# Altium schematic sheet Analog_Modulation_and_Supply.SchDoc
size A3; SheetNumber: 2; SheetTotal: 3
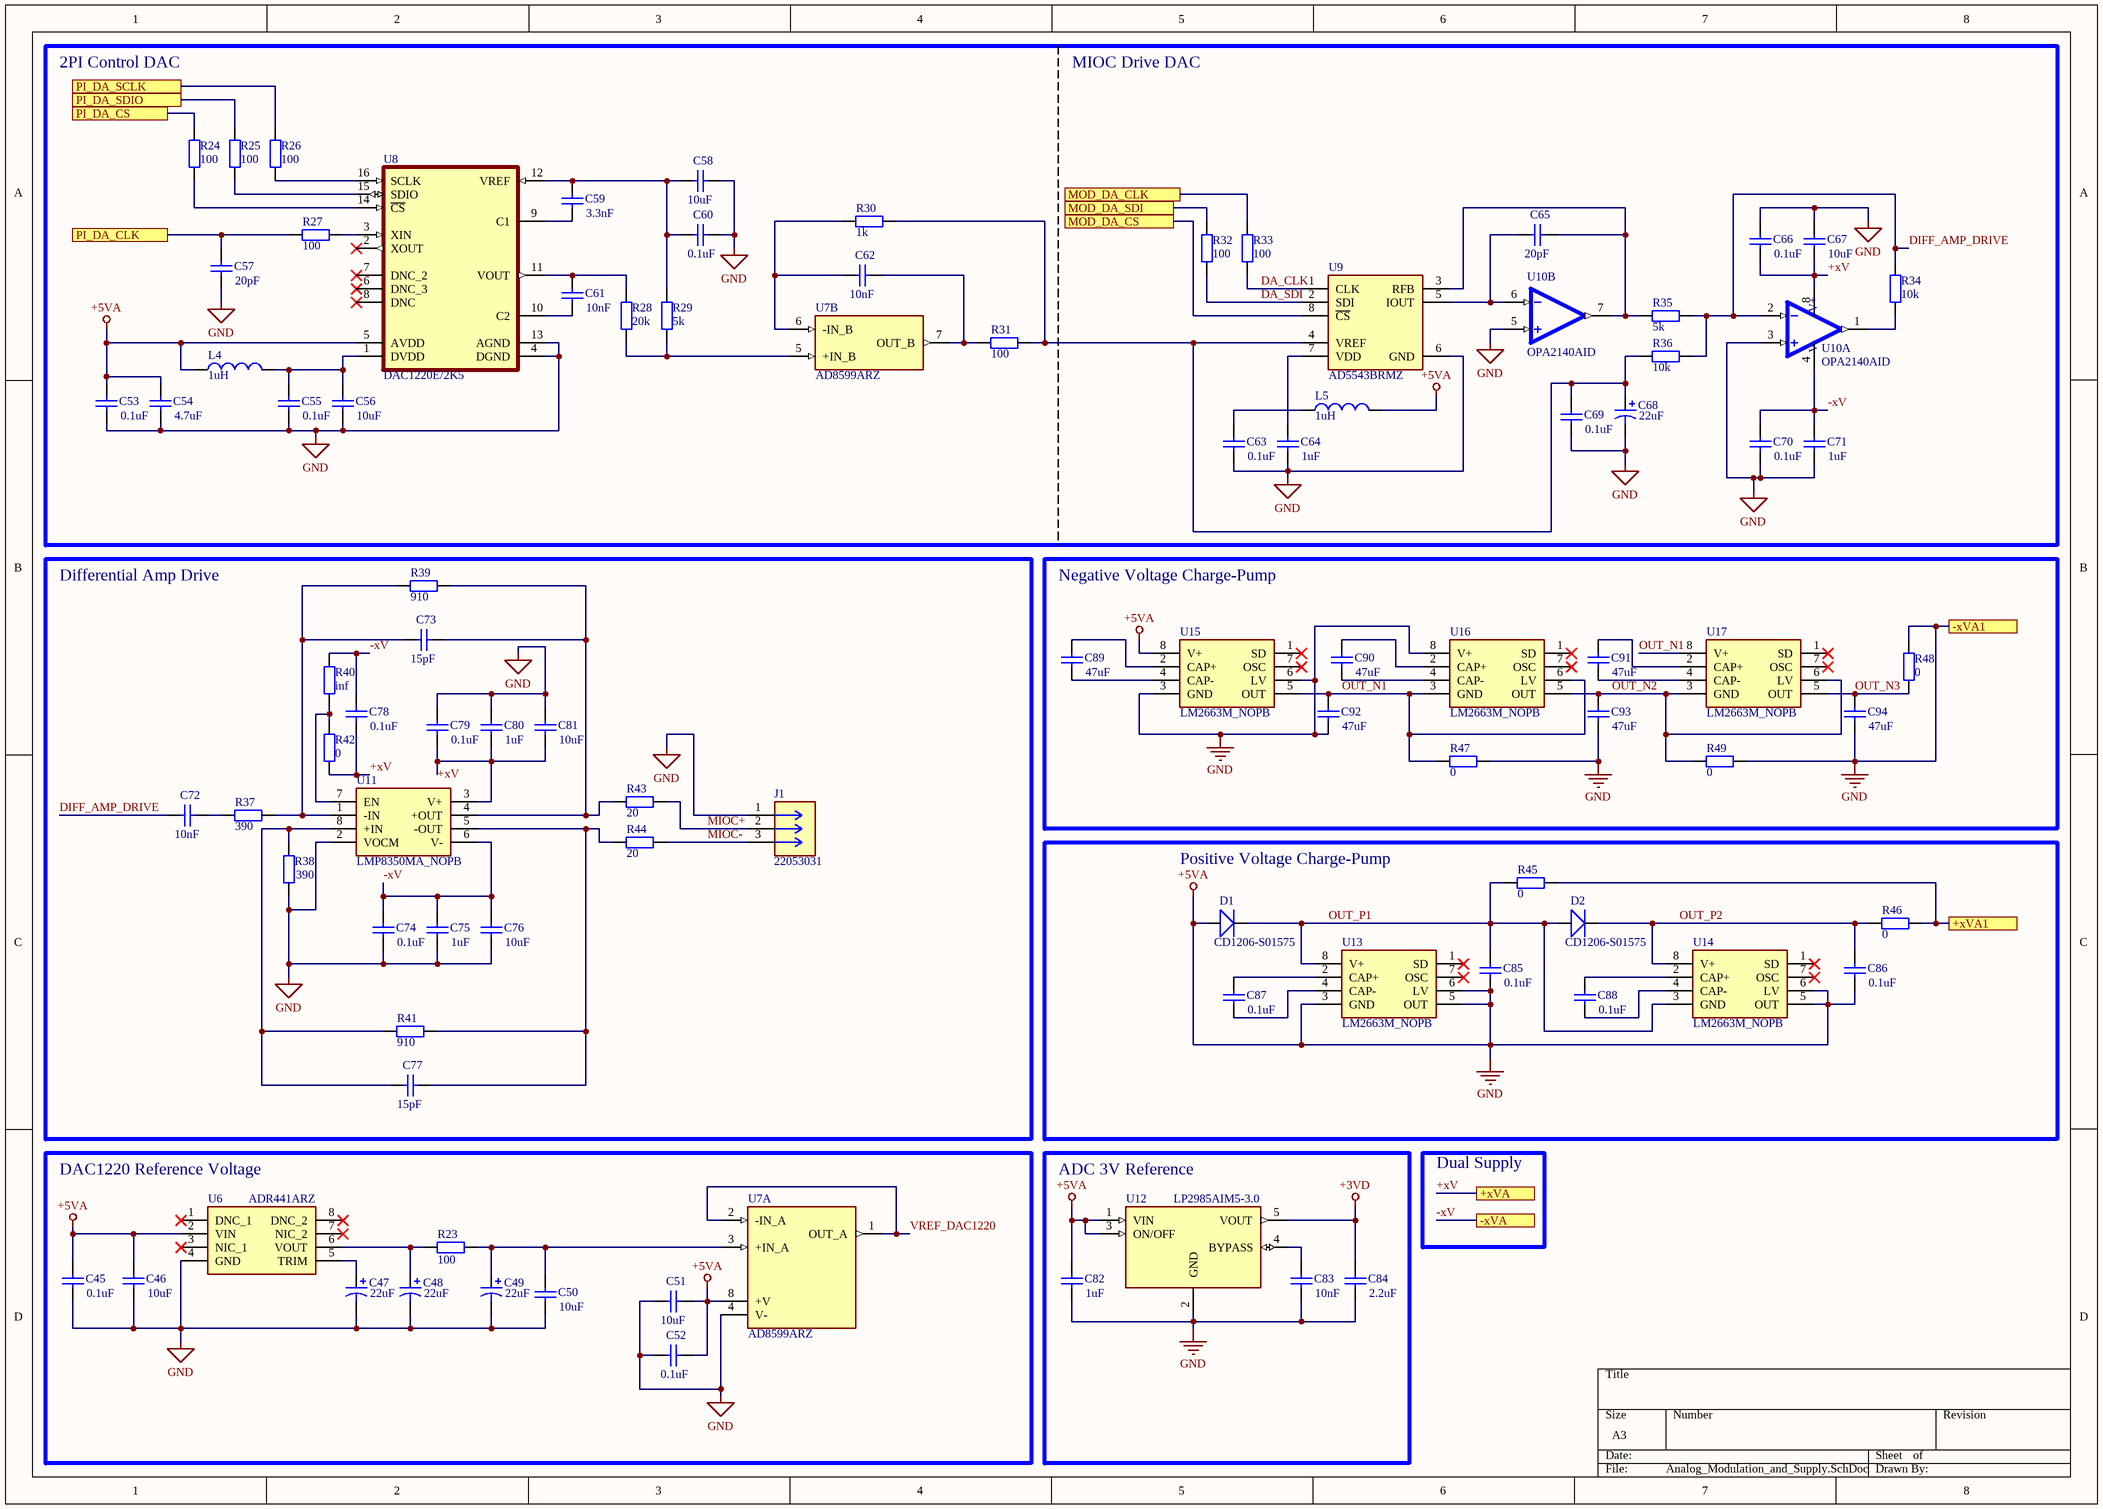
[diagram p0: Analog_Modulation_and_Supply.SchDoc]

## Parts
C45  value 0.1uF  [RAD-0.3]  (hidden comment: Cap)
C46  value 10uF  [RAD-0.3]  (hidden comment: Cap)
C47  value 22uF  [RB7.6-15]  (hidden comment: Cap Pol1)
C48  value 22uF  [RB7.6-15]  (hidden comment: Cap Pol1)
C49  value 22uF  [RB7.6-15]  (hidden comment: Cap Pol1)
C50  value 10uF  [RAD-0.3]  (hidden comment: Cap)
C51  value 10uF  [RAD-0.3]  (hidden comment: Cap)
C52  value 0.1uF  [RAD-0.3]  (hidden comment: Cap)
C53  value 0.1uF  [RAD-0.3]  (hidden comment: Cap)
C54  value 4.7uF  [RAD-0.3]  (hidden comment: Cap)
C55  value 0.1uF  [RAD-0.3]  (hidden comment: Cap)
C56  value 10uF  [RAD-0.3]  (hidden comment: Cap)
C57  value 20pF  [RAD-0.3]  (hidden comment: Cap)
C58  value 10uF  [RAD-0.3]  (hidden comment: Cap)
C59  value 3.3nF  [RAD-0.3]  (hidden comment: Cap)
C60  value 0.1uF  [RAD-0.3]  (hidden comment: Cap)
C61  value 10nF  [RAD-0.3]  (hidden comment: Cap)
C62  value 10nF  [RAD-0.3]  (hidden comment: Cap)
C63  value 0.1uF  [RAD-0.3]  (hidden comment: Cap)
C64  value 1uF  [RAD-0.3]  (hidden comment: Cap)
C65  value 20pF  [RAD-0.3]  (hidden comment: Cap)
C66  value 0.1uF  [RAD-0.3]  (hidden comment: Cap)
C67  value 10uF  [RAD-0.3]  (hidden comment: Cap)
C68  value 22uF  [RB7.6-15]  (hidden comment: Cap Pol1)
C69  value 0.1uF  [RAD-0.3]  (hidden comment: Cap)
C70  value 0.1uF  [RAD-0.3]  (hidden comment: Cap)
C71  value 1uF  [RAD-0.3]  (hidden comment: Cap)
C72  value 10nF  [RAD-0.3]  (hidden comment: Cap)
C73  value 15pF  [RAD-0.3]  (hidden comment: Cap)
C74  value 0.1uF  [RAD-0.3]  (hidden comment: Cap)
C75  value 1uF  [RAD-0.3]  (hidden comment: Cap)
C76  value 10uF  [RAD-0.3]  (hidden comment: Cap)
C77  value 15pF  [RAD-0.3]  (hidden comment: Cap)
C78  value 0.1uF  [RAD-0.3]  (hidden comment: Cap)
C79  value 0.1uF  [RAD-0.3]  (hidden comment: Cap)
C80  value 1uF  [RAD-0.3]  (hidden comment: Cap)
C81  value 10uF  [RAD-0.3]  (hidden comment: Cap)
C82  value 1uF  [RAD-0.3]  (hidden comment: Cap)
C83  value 10nF  [RAD-0.3]  (hidden comment: Cap)
C84  value 2.2uF  [RAD-0.3]  (hidden comment: Cap)
C85  value 0.1uF  [RAD-0.3]  (hidden comment: Cap)
C86  value 0.1uF  [RAD-0.3]  (hidden comment: Cap)
C87  value 0.1uF  [RAD-0.3]  (hidden comment: Cap)
C88  value 0.1uF  [RAD-0.3]  (hidden comment: Cap)
C89  value 47uF  [RAD-0.3]  (hidden comment: Cap)
C90  value 47uF  [RAD-0.3]  (hidden comment: Cap)
C91  value 47uF  [RAD-0.3]  (hidden comment: Cap)
C92  value 47uF  [RAD-0.3]  (hidden comment: Cap)
C93  value 47uF  [RAD-0.3]  (hidden comment: Cap)
C94  value 47uF  [RAD-0.3]  (hidden comment: Cap)
D1  CD1206-S01575  [LED-1206]
D2  CD1206-S01575  [LED-1206]
J1  22053031  [22-05-3031]
L4  value 1uH  [0402-A]  (hidden comment: Inductor)
L5  value 1uH  [0402-A]  (hidden comment: Inductor)
R23  value 100  [AXIAL-0.4]  (hidden comment: Res2)
R24  value 100  [AXIAL-0.4]  (hidden comment: Res2)
R25  value 100  [AXIAL-0.4]  (hidden comment: Res2)
R26  value 100  [AXIAL-0.4]  (hidden comment: Res2)
R27  value 100  [AXIAL-0.4]  (hidden comment: Res2)
R28  value 20k  [AXIAL-0.4]  (hidden comment: Res2)
R29  value 5k  [AXIAL-0.4]  (hidden comment: Res2)
R30  value 1k  [AXIAL-0.4]  (hidden comment: Res2)
R31  value 100  [AXIAL-0.4]  (hidden comment: Res2)
R32  value 100  [AXIAL-0.4]  (hidden comment: Res2)
R33  value 100  [AXIAL-0.4]  (hidden comment: Res2)
R34  value 10k  [AXIAL-0.4]  (hidden comment: Res2)
R35  value 5k  [AXIAL-0.4]  (hidden comment: Res2)
R36  value 10k  [AXIAL-0.4]  (hidden comment: Res2)
R37  value 390  [AXIAL-0.4]  (hidden comment: Res2)
R38  value 390  [AXIAL-0.4]  (hidden comment: Res2)
R39  value 910  [AXIAL-0.4]  (hidden comment: Res2)
R40  value inf  [AXIAL-0.4]  (hidden comment: Res2)
R41  value 910  [AXIAL-0.4]  (hidden comment: Res2)
R42  value 0  [AXIAL-0.4]  (hidden comment: Res2)
R43  value 20  [AXIAL-0.4]  (hidden comment: Res2)
R44  value 20  [AXIAL-0.4]  (hidden comment: Res2)
R45  value 0  [AXIAL-0.4]  (hidden comment: Res2)
R46  value 0  [AXIAL-0.4]  (hidden comment: Res2)
R47  value 0  [AXIAL-0.4]  (hidden comment: Res2)
R48  value 0  [AXIAL-0.4]  (hidden comment: Res2)
R49  value 0  [AXIAL-0.4]  (hidden comment: Res2)
U6  ADR441ARZ  [SOIC127P600X175-8N]
U7  AD8599ARZ  [AD8599ARZ]  (parts A,B of 2)
U8  DAC1220E/2K5  [DAC1220E/2K5]
U9  AD5543BRMZ  [SOP65P490X110-8N]
U10  OPA2140AID  [OPA2140AID]  (parts A,B of 2)
U11  LMP8350MA_NOPB  [LMP8350MA_NOPB]
U12  LP2985AIM5-3.0  [LP2985AIM5-3.0]
U13  LM2663M_NOPB  [LM2663M_NOPB]
U14  LM2663M_NOPB  [LM2663M_NOPB]
U15  LM2663M_NOPB  [LM2663M_NOPB]
U16  LM2663M_NOPB  [LM2663M_NOPB]
U17  LM2663M_NOPB  [LM2663M_NOPB]

## Blocks framed on the sheet
Differential Amp Drive: C72-C81 J1 R37-R44 U11
Negative Voltage Charge-Pump: C89-C94 R47-R49 U15-U17
Positive Voltage Charge-Pump: C85-C88 D1 D2 R45 R46 U13 U14
DAC1220 Reference Voltage: C45-C52 R23 U6 U7
ADC 3V Reference: C82-C84 U12

## Ports
+xVA, +xVA1 (see Digital_Supply_and_Connectors[6A]), -xVA, -xVA1 (see Digital_Supply_and_Connectors[6A]), MOD_DA_CLK (see Digital_Supply_and_Connectors[2B]), MOD_DA_CS (see Digital_Supply_and_Connectors[2B]), MOD_DA_SDI (see Digital_Supply_and_Connectors[2B]), PI_DA_CLK (see Digital_Supply_and_Connectors[2B]), PI_DA_CS (see Digital_Supply_and_Connectors[2B]), PI_DA_SCLK (see Digital_Supply_and_Connectors[3B]), PI_DA_SDIO (see Digital_Supply_and_Connectors[3B])

## Nets
+3VD: C84.1 U12.5(VOUT)
+5VA: C45.1 C45.2 C46.1 C46.2 C47.2 C48.2 C49.2 C50.1 C51.1 C51.2 C52.1 C52.2 C53.1 C53.2 C54.1 C54.2 C55.2 C56.2 C57.2 C58.1 C60.1 C63.2 C64.2 C66.1 C67.1 C68.2 C69.1 C70.2 C71.2 C74.2 C75.2 C76.2 C79.1 C80.1 C81.1 C82.1 C82.2 C83.2 C84.2 C85.2 C86.2 C92.2 C93.2 C94.2 D1.POS J1.1 L4.1 L5.2 R38.2 R47.1 R48.1 R49.1 U6.2(VIN) U6.4(GND) U7.4(V-) U7.8(+V) U8.4(DGND) U8.5(AVDD) U8.13(AGND) U9.6(GND) U10.3(+INA) U10.5(+INB) U11.2(VOCM) U12.1(VIN) U12.2(GND) U12.3(ON/OFF) U13.3(GND) U13.5(OUT) U13.6(LV) U14.5(OUT) U14.6(LV) U15.3(GND) U15.6(LV) U15.8(V+) U16.8(V+) ; port -xVA1  [also labelled GND]
+xV: C66.2 C67.2 C78.2 R42.2 U10.8(V+) ; port +xVA
+xVA1: R45.1 R46.1 ; port +xVA1
-xV: C70.1 C71.1 C74.1 C75.1 C76.1 C78.1 R40.1 U10.4(V-) U11.6(V-) ; port -xVA
DA_CLK: R33.2 U9.1(CLK)
DA_SDI: R32.2 U9.2(SDI)
DIFF_AMP_DRIVE: C72.2 R34.1 R35.1 R36.1 U10.2(-INA)
MIOC+: J1.2 R43.1
MIOC-: J1.3 R44.1
MOD_DA_CLK: R33.1 ; port MOD_DA_CLK
MOD_DA_CS: U9.8(~{CS}) ; port MOD_DA_CS
MOD_DA_SDI: R32.1 ; port MOD_DA_SDI
OUT_N1: C92.1 R47.2 U15.5(OUT) U16.3(GND) U16.6(LV) U17.8(V+)
OUT_N2: C93.1 R49.2 U16.5(OUT) U17.3(GND) U17.6(LV)
OUT_N3: C94.1 R48.2 U17.5(OUT)
OUT_P1: C85.1 D1.NEG D2.POS R45.2 U13.8(V+) U14.3(GND)
OUT_P2: C86.1 D2.NEG R46.2 U14.8(V+)
PI_DA_CLK: C57.1 R27.2 ; port PI_DA_CLK
PI_DA_CS: R24.2 ; port PI_DA_CS
PI_DA_SCLK: R26.2 ; port PI_DA_SCLK
PI_DA_SDIO: R25.2 ; port PI_DA_SDIO
VREF_DAC1220: U7.1(OUT_A) U7.2(-IN_A)
NetC47_1: C47.1 U6.5(TRIM)
NetC48_1: C48.1 R23.1 U6.6(VOUT)
NetC49_1: C49.1 C50.2 R23.2 U7.3(+IN_A)
NetC55_1: C55.1 C56.1 L4.2 U8.1(DVDD)
NetC58_2: C58.2 C59.1 C60.2 R29.2 U8.12(VREF)
NetC59_2: C59.2 U8.9(C1)
NetC61_1: C61.1 R28.2 U8.11(VOUT)
NetC61_2: C61.2 U8.10(C2)
NetC62_1: C62.1 R31.2 U7.7(OUT_B)
NetC62_2: C62.2 R30.2 U7.6(-IN_B)
NetC63_1: C63.1 L5.1
NetC64_1: C64.1 U9.7(VDD)
NetC65_1: C65.1 R35.2 U9.3(RFB) U10.7(OUTB)
NetC65_2: C65.2 U9.5(IOUT) U10.6(-INB)
NetC68_1: C68.1 C69.2 R30.1 R31.1 R36.2 U9.4(VREF)
NetC72_1: C72.1 R37.2
NetC73_1: C73.1 R39.1 R43.2 U11.4(+OUT)
NetC73_2: C73.2 R37.1 R39.2 U11.1(-IN)
NetC77_1: C77.1 R41.1 R44.2 U11.5(-OUT)
NetC77_2: C77.2 R38.1 R41.2 U11.8(+IN)
NetC79_2: C79.2 C80.2 C81.2 U11.3(V+)
NetC83_1: C83.1 U12.4(BYPASS)
NetC87_1: C87.1 U13.2(CAP+)
NetC87_2: C87.2 U13.4(CAP-)
NetC88_1: C88.1 U14.2(CAP+)
NetC88_2: C88.2 U14.4(CAP-)
NetC89_1: C89.1 U15.2(CAP+)
NetC89_2: C89.2 U15.4(CAP-)
NetC90_1: C90.1 U16.2(CAP+)
NetC90_2: C90.2 U16.4(CAP-)
NetC91_1: C91.1 U17.2(CAP+)
NetC91_2: C91.2 U17.4(CAP-)
NetR24_1: R24.1 U8.14(~{CS})
NetR25_1: R25.1 U8.15(SDIO)
NetR26_1: R26.1 U8.16(SCLK)
NetR27_1: R27.1 U8.3(XIN)
NetR28_1: R28.1 R29.1 U7.5(+IN_B)
NetR34_2: R34.2 U10.1(OUTA)
NetR40_2: R40.2 R42.1 U11.7(EN)

Not connected (* = marked no-connect by the designer): U6 1(DNC_1)* 3(NIC_1)* 7(NIC_2)* 8(DNC_2)*; U8 2(XOUT)* 6(DNC_3)* 7(DNC_2)* 8(DNC)*; U13 1(SD)* 7(OSC)*; U14 1(SD)* 7(OSC)*; U15 1(SD)* 7(OSC)*; U16 1(SD)* 7(OSC)*; U17 1(SD)* 7(OSC)*

## Notes on the sheet
- 2PI Control DAC
- MIOC Drive DAC
- Dual Supply
- Labels drawn without touching a wire or pin: +xV

## Library data of the parts
C45 C46 C50-C67 C69-C94 = Cap: Capacitor; Published: 8-Jun-2000; LatestRevisionDate: 17-Jul-2002; LatestRevisionNote: Re-released for DXP Platform.; PackageReference: RAD-0.3; Publisher: Altium Limited; PackageDescription: Radial Cap, Thru-Hole; 2 Leads; 0.3 in Pin Spacing
C47-C49 C68 = Cap Pol1: Polarized Capacitor (Radial); Published: 8-Jun-2000; LatestRevisionDate: 17-Jul-2002; LatestRevisionNote: Re-released for DXP Platform.; PackageReference: RB7.6-15; Publisher: Altium Limited; PackageDescription: Polarized Capacitor (Radial); 2 Leads
D1 D2 = CD1206-S01575: CD1206-S01575, SMT Switching Diode, Vr=75V 150mA, 4ns, 2-Pin 1206 | Bourns CD1206-S01575; SnapEDA_Link: https://www.snapeda.com/parts/CD1206-S01575/Bourns/view-part/?ref=snap; Package: 1206 Bourns; Value: *; MF: Bourns; MP: CD1206-S01575; Check_prices: https://www.snapeda.com/parts/CD1206-S01575/Bourns/view-part/?ref=eda
J1 = 22053031: Headers R/A PCB HDR 3P TIN FRICTION LOCK | Molex Incorporated 22-05-3031; SnapEDA_Link: https://www.snapeda.com/parts/22-05-3031/Molex/view-part/?ref=snap; Package: None; Value: *; MF: Molex; MP: 22-05-3031; Check_prices: https://www.snapeda.com/parts/22-05-3031/Molex/view-part/?ref=eda
L4 L5 = Inductor: Code_IEC: 1005; Published: 8-Jun-2000; LatestRevisionDate: 29-May-2009; LatestRevisionNote: IPC-7351 Footprint Added.; PackageReference: 0402-A; Publisher: Altium Limited; PackageDescription: Chip Inductor; Code_JEITA: 0402
R23-R49 = Res2: Resistor; Published: 8-Jun-2000; LatestRevisionDate: 17-Jul-2002; LatestRevisionNote: Re-released for DXP Platform.; PackageReference: AXIAL-0.4; Publisher: Altium Limited; PackageDescription: Axial Device, Thru-Hole; 2 Leads; 0.4 in Pin Spacing
U6 = ADR441ARZ: Series Voltage Reference IC Fixed 2.5V V +/-0.12% 10 mA 8-SOIC; Manufacturer_Name: Analog Devices; Geometry.Height: 1.75mm; Manufacturer_Part_Number: ADR441ARZ; Mouser Part Number: 584-ADR441ARZ; Mouser Price/Stock: https://www.mouser.co.uk/ProductDetail/Analog-Devices/ADR441ARZ?qs=WIvQP4zGanjF%252B9HT%2FrItQQ%3D%3D; Arrow Part Number: ADR441ARZ; Arrow Price/Stock: https://www.arrow.com/en/products/adr441arz/analog-devices?region=europe; Datasheet Link: https://www.analog.com/media/en/technical-documentation/data-sheets/adr440_441_443_444_445.pdf
U7 = AD8599ARZ: Ultralow Distortion, Ultralow Noise Op Amp (Dual); MF: Analog Devices; Package: SOIC-8 Analog Devices; Price: None; Check_prices: https://www.snapeda.com/parts/AD8599ARZ/Analog+Devices/view-part/?ref=eda; Value: *; SnapEDA_Link: https://www.snapeda.com/parts/AD8599ARZ/Analog+Devices/view-part/?ref=snap; MP: AD8599ARZ; Availability: In Stock; Purchase-URL: https://pricing.snapeda.com/search?q=AD8599ARZ&ref=eda
U8 = DAC1220E/2K5: Digital-to-Analog Converter; Package: None; Price: None; Value: *; MP: DAC1220E/2K5; Availability: Unavailable
U9 = AD5543BRMZ: AD5543BRMZ, 16-Bit General Purpose DAC 2.47Msps, SPI, 8-Pin MSOP; Manufacturer_Name: Analog Devices; Geometry.Height: 1.1mm; Manufacturer_Part_Number: AD5543BRMZ; Mouser Part Number: 584-AD5543BRMZ; Mouser Price/Stock: https://www.mouser.co.uk/ProductDetail/Analog-Devices/AD5543BRMZ?qs=NmRFExCfTkGF7F9gS5LwsA%3D%3D; Arrow Part Number: AD5543BRMZ; Arrow Price/Stock: https://www.arrow.com/en/products/ad5543brmz/analog-devices?utm_currency=USD&region=nac; Datasheet Link: http://www.analog.com/static/imported-files/data_sheets/AD5543_5553.pdf
U10 = OPA2140AID: Dual-channel, 11-MHz, low-noise 36-V JFET precision operational amplifier with rail-to-rail output; MF: Texas Instruments; SnapEDA_Link: https://www.snapeda.com/parts/OPA2140AID/Texas+Instruments/view-part/?ref=snap; Package: SOIC-8 Texas Instruments; Value: *; MP: OPA2140AID; Check_prices: https://www.snapeda.com/parts/OPA2140AID/Texas+Instruments/view-part/?ref=eda
U11 = LMP8350MA_NOPB: Ultra Low Distortion Fully Differential Precision ADC Driver with Selectable Power Modes; Manufacturer_Name: Texas Instruments; Manufacturer_Part_Number: LMP8350MA/NOPB; Geometry.Height: 1.75mm; Mouser Part Number: 926-LMP8350MA/NOPB; Mouser Price/Stock: https://www.mouser.co.uk/ProductDetail/Texas-Instruments/LMP8350MA-NOPB?qs=OYMYEaN9QmBOQoVkyNgTKw%3D%3D; Arrow Part Number: LMP8350MA/NOPB; Arrow Price/Stock: null?region=nac; Datasheet Link: http://www.ti.com/lit/gpn/lmp8350
U12 = LP2985AIM5-3.0: 150-mA, 16-V, low-dropout voltage regulator with enable; MF: Texas Instruments; MP: LP2985AIM5-3.0/NOPB; SnapEDA_Link: https://www.snapeda.com/parts/LP2985AIM5-3.0/NOPB/Texas+Instruments/view-part/?ref=snap; Package: SOT-23-5 Texas Instruments; Value: *; Check_prices: https://www.snapeda.com/parts/LP2985AIM5-3.0/NOPB/Texas+Instruments/view-part/?ref=eda
U13-U17 = LM2663M_NOPB: 200mA switched capacitor voltage converter with low current shutdown mode; Manufacturer_Name: Texas Instruments; Manufacturer_Part_Number: LM2663M/NOPB; Geometry.Height: 1.75mm; Mouser Part Number: 926-LM2663M/NOPB; Mouser Price/Stock: https://www.mouser.co.uk/ProductDetail/Texas-Instruments/LM2663M-NOPB?qs=X1J7HmVL2ZH655akkcil2g%3D%3D; Arrow Part Number: LM2663M/NOPB; Arrow Price/Stock: https://www.arrow.com/en/products/lm2663mnopb/texas-instruments?utm_currency=USD&region=europe; Datasheet Link: http://www.ti.com/lit/ds/symlink/lm2663.pdf